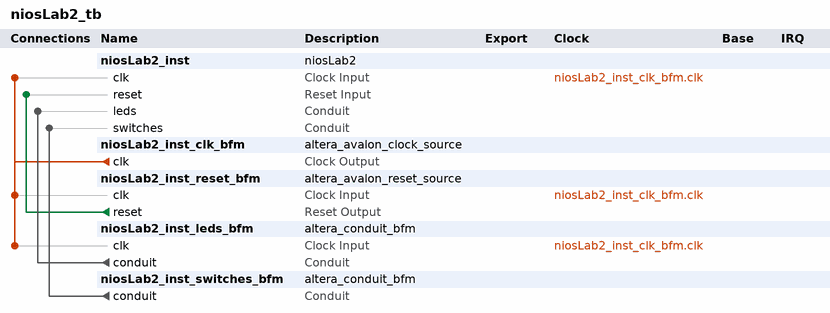
[diagram p0: system contents]
# Platform Designer (Qsys) system niosLab2_tb, Cyclone V 5CSXFC6D6F31C6
# Parameters at their usual value, and those the tool derives, are not listed.
package require -exact qsys 18.1
create_system niosLab2_tb
set_project_property DEVICE_FAMILY {Cyclone V}
set_project_property DEVICE 5CSXFC6D6F31C6

add_instance niosLab2_inst niosLab2 1.0

add_instance niosLab2_inst_clk_bfm altera_avalon_clock_source 18.1

add_instance niosLab2_inst_reset_bfm altera_avalon_reset_source 18.1
set_instance_parameter_value niosLab2_inst_reset_bfm ASSERT_HIGH_RESET 0
set_instance_parameter_value niosLab2_inst_reset_bfm INITIAL_RESET_CYCLES 50

add_instance niosLab2_inst_leds_bfm altera_conduit_bfm 18.1
set_instance_parameter_value niosLab2_inst_leds_bfm CLOCKED_SIGNAL true
set_instance_parameter_value niosLab2_inst_leds_bfm ENABLE_RESET false
set_instance_parameter_value niosLab2_inst_leds_bfm SIGNAL_DIRECTIONS input
set_instance_parameter_value niosLab2_inst_leds_bfm SIGNAL_ROLES name
set_instance_parameter_value niosLab2_inst_leds_bfm SIGNAL_WIDTHS 4

add_instance niosLab2_inst_switches_bfm altera_conduit_bfm 18.1
set_instance_parameter_value niosLab2_inst_switches_bfm CLOCKED_SIGNAL false
set_instance_parameter_value niosLab2_inst_switches_bfm ENABLE_RESET false
set_instance_parameter_value niosLab2_inst_switches_bfm SIGNAL_DIRECTIONS output
set_instance_parameter_value niosLab2_inst_switches_bfm SIGNAL_WIDTHS 6

# connections
add_connection niosLab2_inst_clk_bfm.clk niosLab2_inst.clk clock
add_connection niosLab2_inst_clk_bfm.clk niosLab2_inst_leds_bfm.clk clock
add_connection niosLab2_inst_clk_bfm.clk niosLab2_inst_reset_bfm.clk clock
add_connection niosLab2_inst_reset_bfm.reset niosLab2_inst.reset reset
add_connection niosLab2_inst_leds_bfm.conduit niosLab2_inst.leds conduit
add_connection niosLab2_inst_switches_bfm.conduit niosLab2_inst.switches conduit

set_interconnect_requirement {$system} qsys_mm.clockCrossingAdapter HANDSHAKE
set_interconnect_requirement {$system} qsys_mm.enableEccProtection FALSE
set_interconnect_requirement {$system} qsys_mm.insertDefaultSlave FALSE
set_interconnect_requirement {$system} qsys_mm.maxAdditionalLatency 1

save_system niosLab2_tb.qsys
